# EAGLE design currentsensor (EAGLE 5.11)
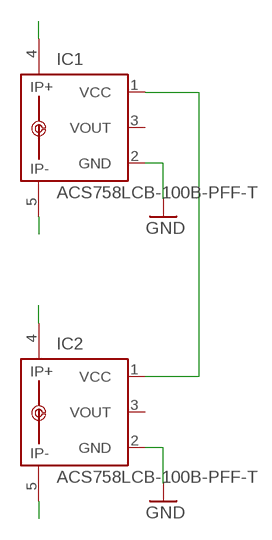
[diagram p0: schematic, sheet 1]

## Parts
IC1  ACS758LCB-100B-PFF-T  [CB-PFF]
IC2  ACS758LCB-100B-PFF-T  [CB-PFF]

## Nets
GND: IC1.2(GND) IC2.2(GND)
N$1: IC1.1(VCC) IC2.1(VCC)
N$2: IC1.4(IP+)
N$3: IC1.5(IP-)
N$4: IC2.4(IP+)
N$5: IC2.5(IP-)
Unconnected: IC1.3(VOUT) IC1.IP+1 IC1.IP-1 IC2.3(VOUT) IC2.IP+1 IC2.IP-1

## Library data of the parts
IC1 IC2 = allegro:ACS758*: Thermally Enhanced, Fully Integrated, Hall Effect-Based Linear Current Sensor with 100 micro Ohm Current Conductor display layer 49 Reference in BRD and place VIAs on circles Source: http://www.allegromicro.com/en/Products/Part_Numbers/0758/0758.pdf; MPN: ACS758LCB-100B-PFF-T; OC_FARNELL: 1718998; OC_NEWARK: 04R7132

## Board
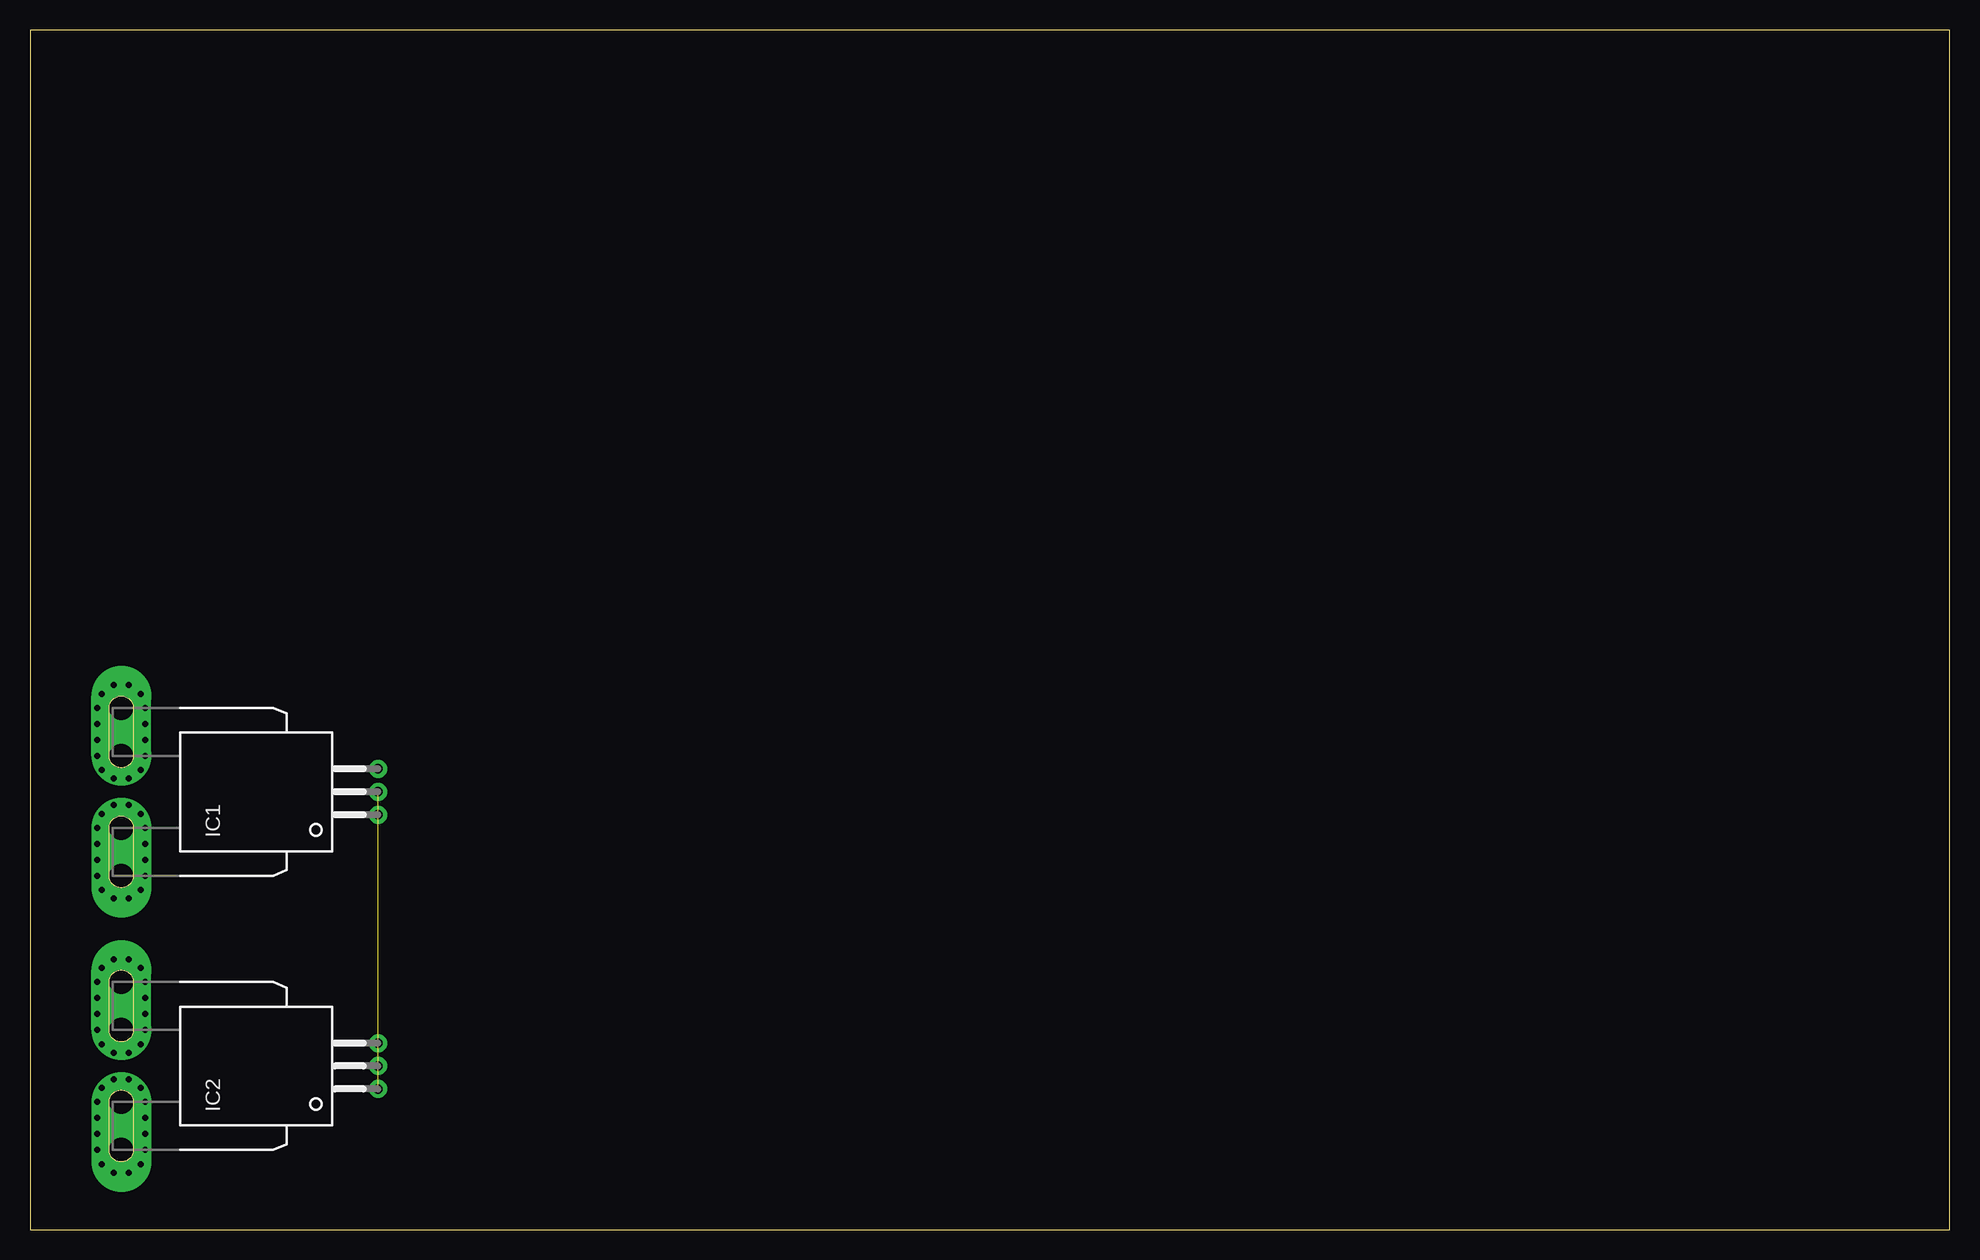
[diagram p1: board, top side]
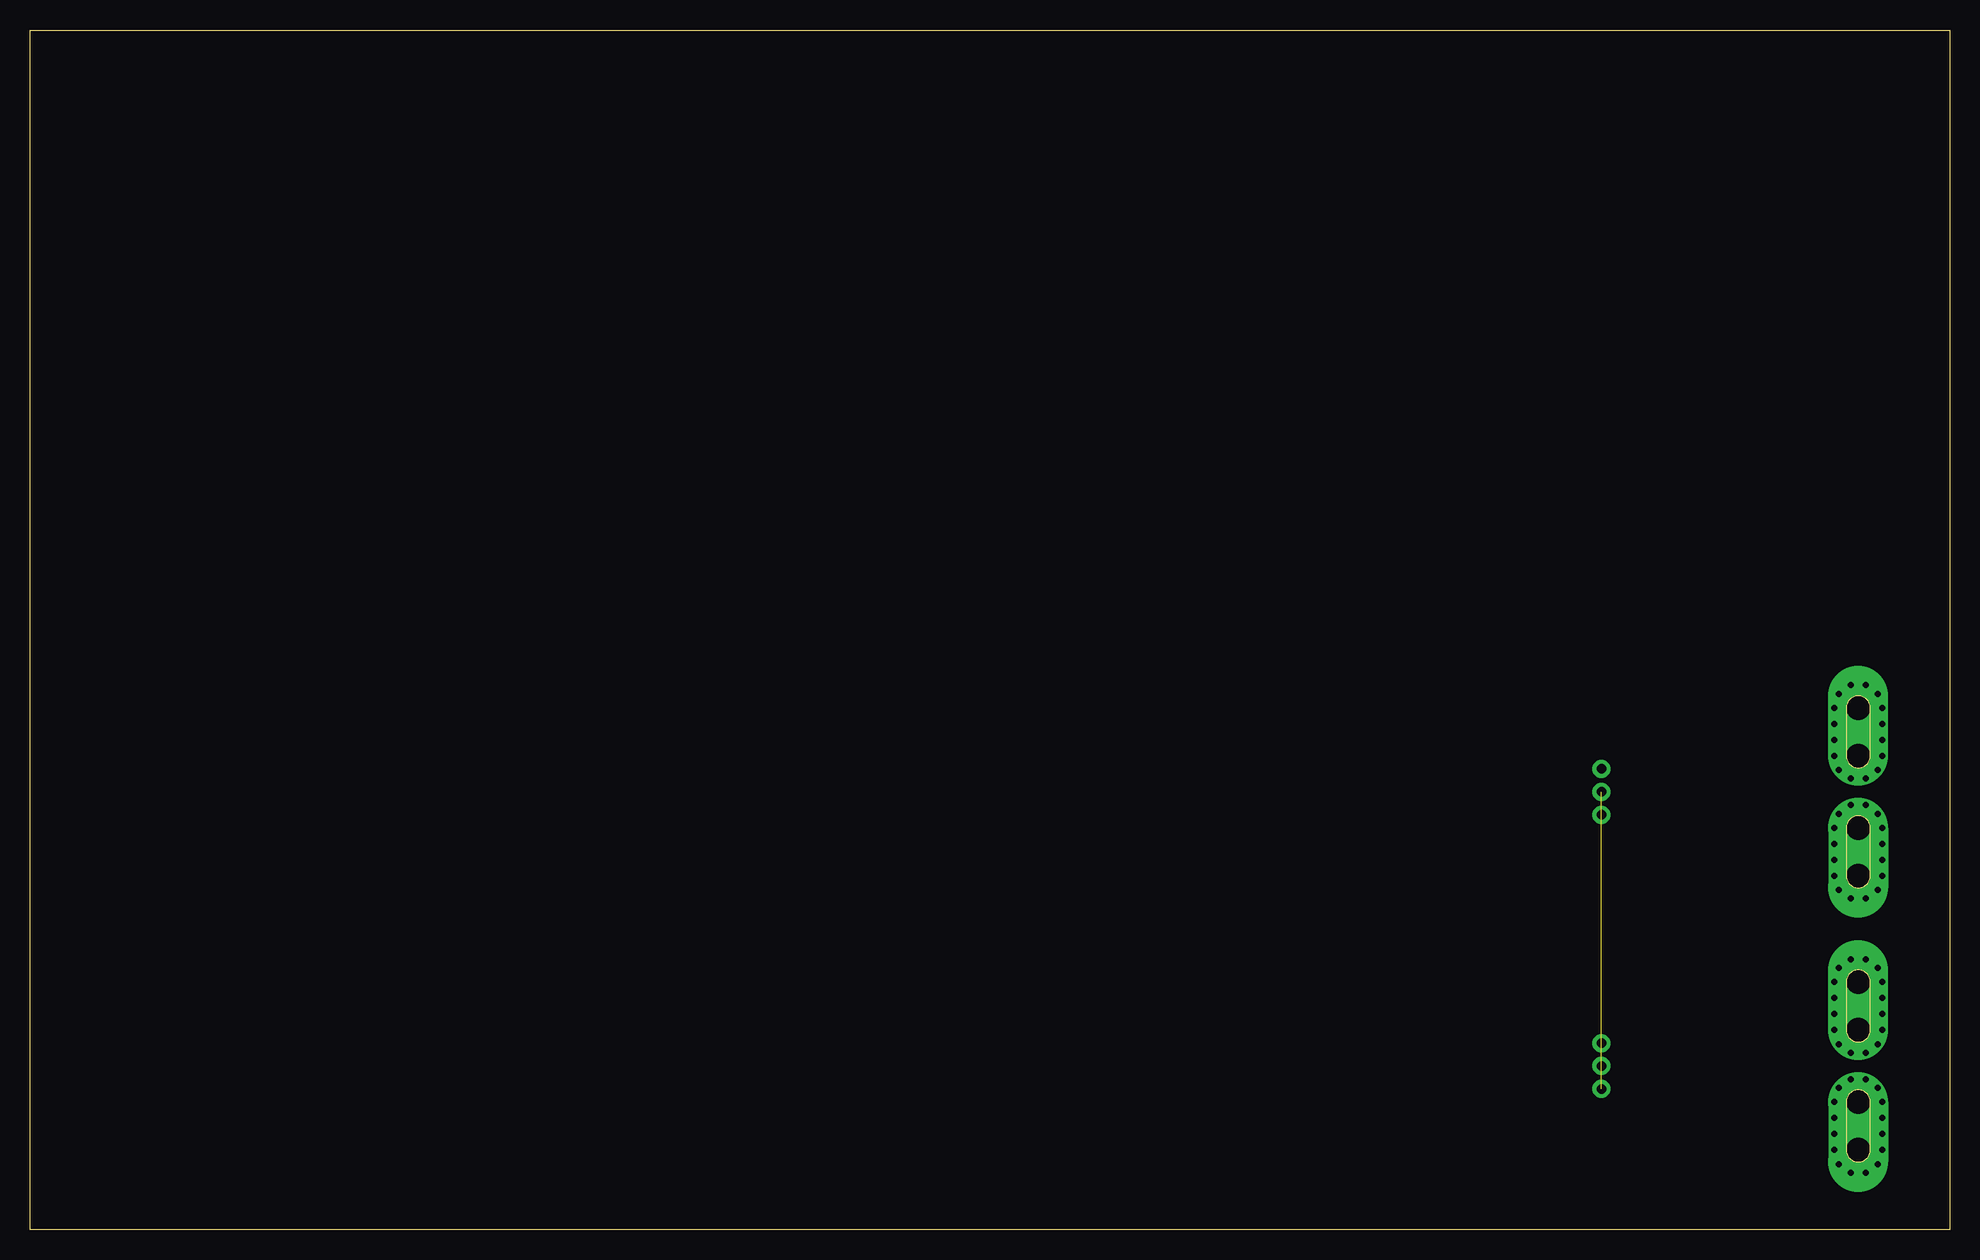
[diagram p2: board, bottom side, seen from below]

Size 160 x 100 mm. Coordinates in mm from the lower left corner, seen from the top.
Outline: 0,0 160,0 160,100 0,100 0,0
Copper layers (1*16): Top 0.035mm / dielectric 1.5mm / Bottom 0.035mm
Design rules "default": minimum track width 10mil, minimum drill 24mil, track to track 8mil, track to pad 8mil, pad to pad 8mil, via to via 8mil, smd to smd 8mil, copper to edge 40mil, drill to drill 8mil, minimum pad ring 10mil, minimum via ring 8mil, stop-mask expansion 4mil, vias tented up to drill 0mil, thermal gap 10mil

### Footprints (pad centres in the part's own frame; a part is rotated, then mirrored left to right if it is on the bottom)
CB-PFF = drill 0.8 pad 1.5 round: 1 -1.91,-21.4; 2 0,-21.4; 3 1.91,-21.4 | drill 2 pad 5 offset: 4 3,0; 5 -3,0 | drill 2 pad 4 offset: IP+1 7,0; IP-1 -7,0

### Placement (x,y rotation side)
IC1  7.61,36.49 90 top
IC2  7.61,13.63 90 top

### Tracks (layer width: path | path; a pad name or v marks a point on that pad's centre or on a via)
GND  (1 unrouted)
N$1  (1 unrouted)
N$2  (via drill 0.5)
  Bottom 0.406: v5.61,39.49 v5.99,38.31 v6.99,37.59 v8.22,37.59 v9.22,38.31 v9.61,39.49 v9.61,40.82 v9.61,42.16 v9.61,43.49 v9.22,44.66 v8.22,45.39 v6.99,45.39 v5.99,44.66 v5.61,43.49 v5.61,42.16 | v5.61,39.49 v5.61,40.82 | v5.61,39.49 IC1.4
N$3  (via drill 0.5)
  Bottom 0.406: v5.61,30.82 v5.61,29.49 v5.99,28.32 v6.99,27.59 v8.22,27.59 v9.22,28.32 v9.61,29.49 v9.61,30.82 v9.61,32.16 v9.61,33.49 | v5.61,32.16 v5.61,33.49 v5.99,34.66 v6.99,35.39 v8.22,35.39 v9.22,34.66 v9.61,33.49 | v9.61,33.49 IC1.5
N$4  (via drill 0.5)
  Bottom 0.406: v9.61,19.3 v9.61,20.63 v9.22,21.8 v8.22,22.53 v6.99,22.53 v5.99,21.8 v5.61,20.63 v5.61,19.3 v5.61,17.96 v5.61,16.63 v5.99,15.46 v6.99,14.73 v8.22,14.73 v9.22,15.46 v9.61,16.63 | v9.61,16.63 v9.61,17.96 | v9.61,16.63 IC2.4
N$5  (via drill 0.5)
  Bottom 0.406: v9.61,9.3 v9.61,10.63 v9.22,11.8 v8.22,12.53 v6.99,12.53 v5.99,11.8 v5.61,10.63 | v5.61,10.63 v5.61,9.3 v5.61,7.96 v5.61,6.63 v5.99,5.46 v6.99,4.73 v8.22,4.73 v9.22,5.46 v9.61,6.63 v9.61,7.96 | v5.61,10.63 IC2.5